# Altium schematic sheet WdTest.SchDoc: Watchdog Test IC
size A4; Author: Adam Mizerkiewicz; CompanyName: Saule S.A.; DrawnBy: Adam Mizerkiewicz; Organization: Saule S.A.; Address1: Ul. Duńska 11; Address2: 54-427 Wrocław; DocumentNumber: 38; SheetNumber: 41; SheetTotal: 42
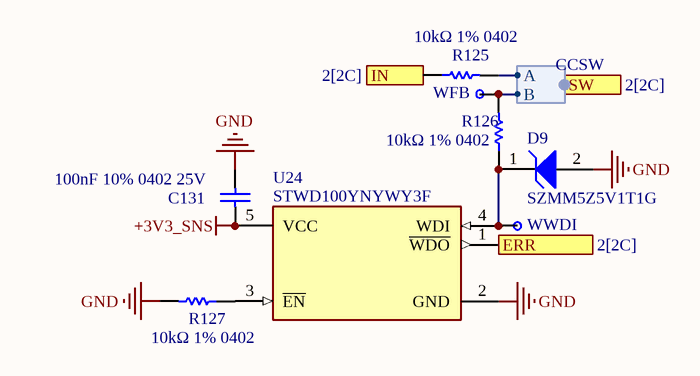
[diagram p0: WdTest.SchDoc]

## Parts
C131  100nF 10% 0402 25V  [0402N]
D9  SZMM5Z5V1T1G  [ONSC-SOD-523-2-502-01_V]
R125  10kΩ 1% 0402  [0402N]
R126  10kΩ 1% 0402  [0402N]
R127  10kΩ 1% 0402  [0402N]
U24  STWD100YNYWY3F  [FP-SOT23-5-IPC_B]
WFB  Testpoint  [Testpoint-Footprint-1]  (value not drawn)  (no BOM)
WWDI  Testpoint  [Testpoint-Footprint-1]  (value not drawn)  (no BOM)

## Ports
ERR (out, see 2[2C]), IN (in, see 2[2C]), SW (in, harness CCSW, see 2[2C])

## Harnesses
CCSW: A, B

## Nets
+3V3_SNS: C131.1 U24.5(VCC)
GND: C131.2 D9.2(A) R127.2 U24.2(GND)
ERR: U24.1(~{WDO}) ; port ERR
IN: R125.1 ; port IN
NetD9_1: D9.1(K) R126.1 U24.4(WDI) WWDI.1
NetR125_2: R125.2 ; port SW.A
NetR126_2: R126.2 WFB.1 ; port SW.B
NetR127_1: R127.1 U24.3(~{EN})

## Notes on the sheet
- Title
- Size:
- Date:
- A4
- Number:
- Time:
- Revision:
- Sheet
- of
- File:

## Library data of the parts
C131 = C0402: Capacitance: 100n; Tolerance: 10; Voltage: 25; Footprint: 0402
D9 = CMP-1060-00775-1: Zener Voltage Regulator, 500 mW, 2-Pin SOD-523, Pb-Free, Tape and Reel; Manufacturer: On Semiconductor; VZ Typ (V): 5.1; P Max (W): 0.5; RoHS: Pb-Free; ComponentLink2Description: Datasheet; ComponentLink3URL: http://www.onsemi.com/pub_link/Collateral/502-01.PDF; DatasheetVersion: Rev. 10; ComponentLink3Description: Package Specification; PackageReference: SOD-523-2-502-01; Mounting Technology: Surface Mount; PackageDescription: 2-Pin SOD, Body 1.2 x 0.8 mm; PackageVersion: Rev. E, 09/2010; ComponentLink1Description: Manufacturer URL; ComponentLink2URL: http://www.onsemi.cn/pub_link/Collateral/MM5Z2V4T1-D.PDF; Packing: Tape and Reel; ComponentLink1URL: http://www.onsemi.com/; PartNumber: SZMM5Z5V1T1G
R125-R127 = R0402: Resistance: 10k; Tolerance: 1; Footprint: 0402
U24 = CMP-12155-000006-1: IC SUPERVISOR 1 CHANNEL SOT23-5; Max Supply Voltage: 5.5V; Reset Timeout: 1.12s; Number of Monitored Inputs: 1; Reset: Active Low; Max Power Dissipation: 320mW; Operating Supply Current: 13uA; Min Supply Voltage: 2.7V; RoHS Compliant: Yes; Mount: Surface Mount; Type: Watchdog Circuit; Package Quantity: 1; Case/Package: SOT-23-5; Max Operating Temperature: 125°C; Contact Plating: Gold; Min Operating Temperature: -40°C; Packaging: Tape and Reel; Lead Free: Lead Free; Number of Voltages Monitored: 1; Radiation Hardening: No; Number of Pins: 5
WFB WWDI = CMP-003-000002-1